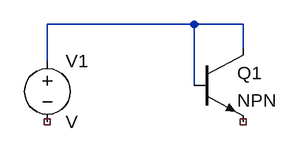
[diagram p0: schematic Draft1.asc]
Draft1.asc, the LTspice schematic file:
Version 4
SHEET 1 880 680
WIRE 192 48 0 48
WIRE 256 48 192 48
WIRE 256 80 256 48
WIRE 0 96 0 48
WIRE 192 128 192 48
SYMBOL npn 192 80 R0
SYMATTR InstName Q1
SYMBOL voltage 0 80 R0
SYMATTR InstName V1

The netlist it stands for:
* Draft1.asc
Q1 N001 N001 NC_01 0 NPN
V1 N001 NC_02 V
.model NPN NPN
.model PNP PNP
.lib standard.bjt
.backanno
.end